# Altium schematic sheet Joystick.SchDoc
size A
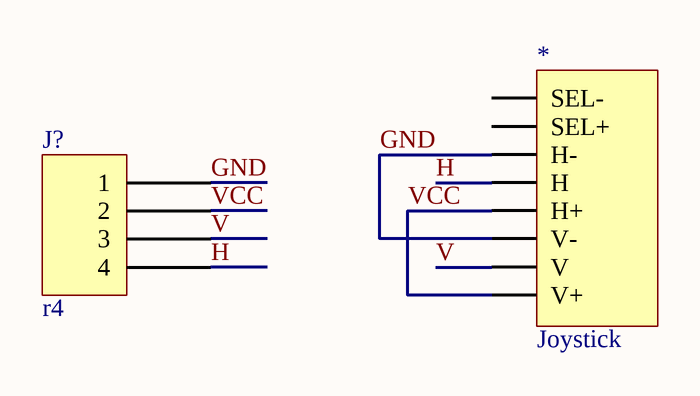
[diagram p0: Joystick.SchDoc]

## Parts
*  Joystick  [Joystick]
J?  r4  [MOLEX SDA-70553-4PIN]

## Nets
GND: *.H3(H-) *.V3(V-) J?.1
H: *.H2(H) J?.4
V: *.V2(V) J?.3
VCC: *.H1(H+) *.V1(V+) J?.2

Not connected (* = marked no-connect by the designer): * S1(SEL+) S2(SEL-)